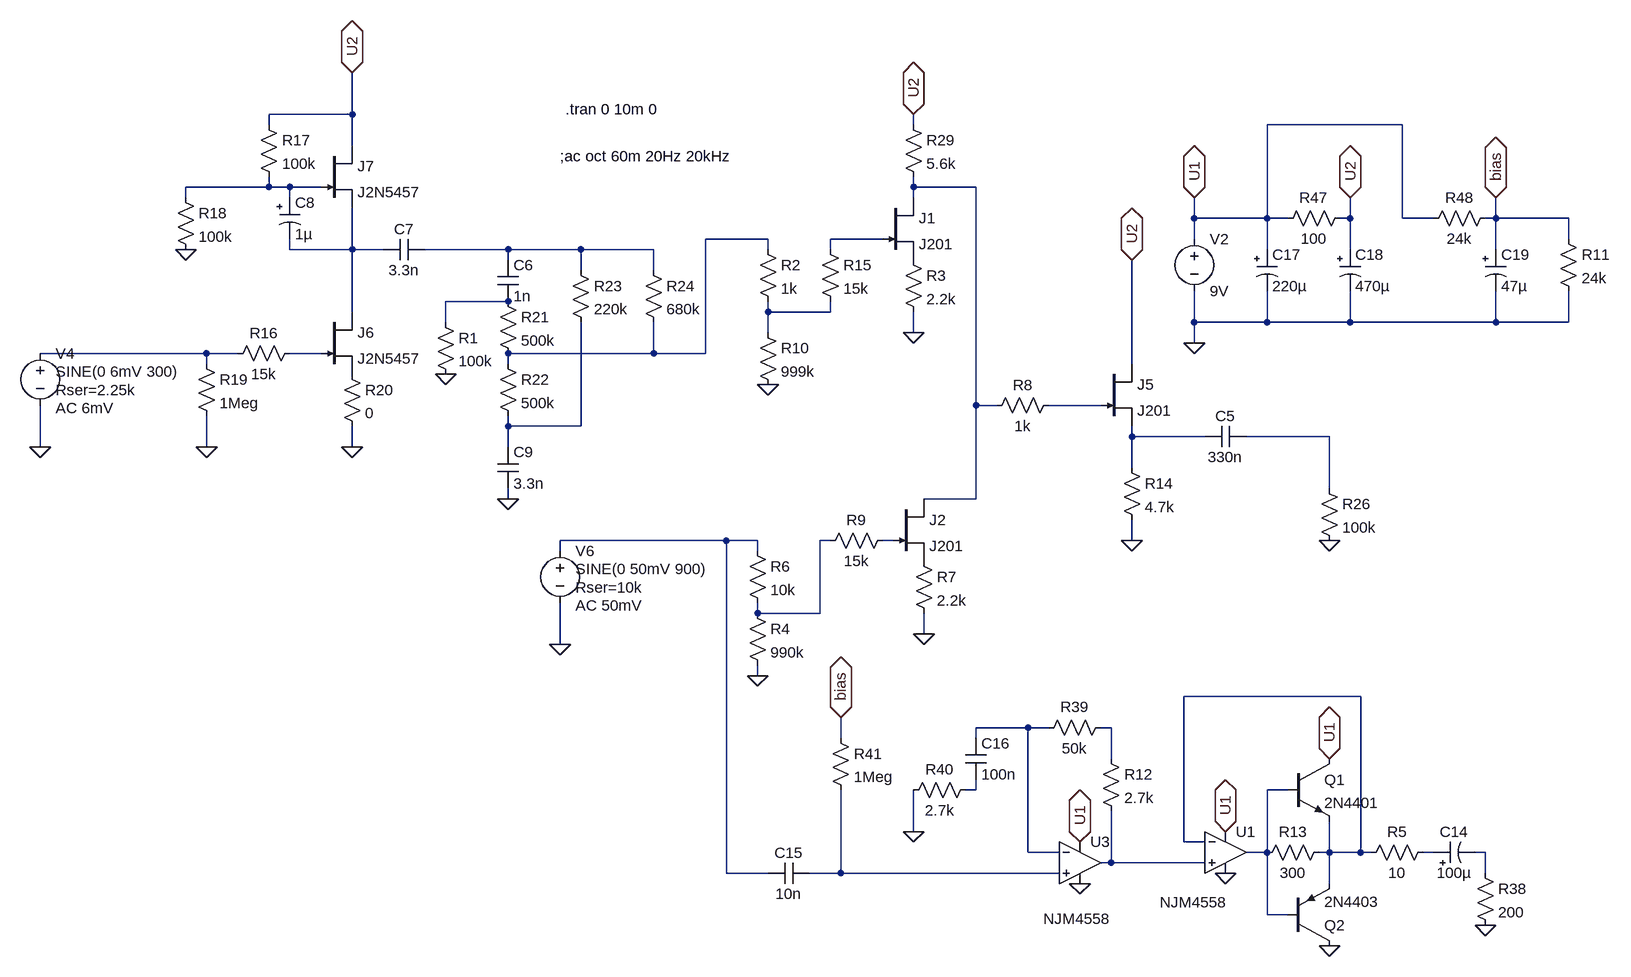
[diagram p0: schematic spudnik reverb pedal.asc]
spudnik reverb pedal.asc, the LTspice schematic file:
Version 4
SHEET 1 2768 708
WIRE -3040 -1296 -3040 -1360
WIRE -3040 -1296 -3168 -1296
WIRE -3168 -1280 -3168 -1296
WIRE -2176 -1280 -2176 -1296
WIRE -1424 -1280 -1632 -1280
WIRE -3040 -1248 -3040 -1296
WIRE -3168 -1184 -3168 -1200
WIRE -3168 -1184 -3296 -1184
WIRE -3136 -1184 -3168 -1184
WIRE -3088 -1184 -3136 -1184
WIRE -2176 -1184 -2176 -1200
WIRE -2080 -1184 -2176 -1184
WIRE -3296 -1168 -3296 -1184
WIRE -3136 -1168 -3136 -1184
WIRE -2176 -1168 -2176 -1184
WIRE -1744 -1136 -1744 -1168
WIRE -1632 -1136 -1632 -1280
WIRE -1632 -1136 -1744 -1136
WIRE -1600 -1136 -1632 -1136
WIRE -1504 -1136 -1504 -1168
WIRE -1504 -1136 -1520 -1136
WIRE -1424 -1136 -1424 -1280
WIRE -1376 -1136 -1424 -1136
WIRE -1280 -1136 -1280 -1168
WIRE -1280 -1136 -1296 -1136
WIRE -1168 -1136 -1280 -1136
WIRE -2400 -1104 -2496 -1104
WIRE -2224 -1104 -2304 -1104
WIRE -1744 -1104 -1744 -1136
WIRE -1168 -1104 -1168 -1136
WIRE -3136 -1088 -3136 -1104
WIRE -3040 -1088 -3040 -1152
WIRE -3040 -1088 -3136 -1088
WIRE -2992 -1088 -3040 -1088
WIRE -2800 -1088 -2928 -1088
WIRE -2688 -1088 -2800 -1088
WIRE -2576 -1088 -2688 -1088
WIRE -2400 -1088 -2400 -1104
WIRE -2304 -1088 -2304 -1104
WIRE -1632 -1088 -1632 -1136
WIRE -1504 -1088 -1504 -1136
WIRE -1280 -1088 -1280 -1136
WIRE -2800 -1072 -2800 -1088
WIRE -2688 -1056 -2688 -1088
WIRE -2576 -1056 -2576 -1088
WIRE -2800 -1008 -2896 -1008
WIRE -3040 -992 -3040 -1088
WIRE -2400 -992 -2400 -1008
WIRE -2304 -992 -2304 -1008
WIRE -2304 -992 -2400 -992
WIRE -2896 -976 -2896 -1008
WIRE -1744 -976 -1744 -1024
WIRE -1632 -976 -1632 -1024
WIRE -1632 -976 -1744 -976
WIRE -1504 -976 -1504 -1024
WIRE -1504 -976 -1632 -976
WIRE -1280 -976 -1280 -1024
WIRE -1280 -976 -1504 -976
WIRE -1168 -976 -1168 -1024
WIRE -1168 -976 -1280 -976
WIRE -2400 -960 -2400 -992
WIRE -2176 -960 -2176 -992
WIRE -1744 -944 -1744 -976
WIRE -3264 -928 -3520 -928
WIRE -3216 -928 -3264 -928
WIRE -3088 -928 -3136 -928
WIRE -2576 -928 -2576 -976
WIRE -2576 -928 -2800 -928
WIRE -2496 -928 -2496 -1104
WIRE -2496 -928 -2576 -928
WIRE -3264 -912 -3264 -928
WIRE -2800 -912 -2800 -928
WIRE -1840 -912 -1840 -1072
WIRE -2080 -848 -2080 -1184
WIRE -2048 -848 -2080 -848
WIRE -1888 -848 -1968 -848
WIRE -2800 -816 -2800 -832
WIRE -2688 -816 -2688 -976
WIRE -2688 -816 -2800 -816
WIRE -1840 -800 -1840 -816
WIRE -1728 -800 -1840 -800
WIRE -1536 -800 -1664 -800
WIRE -3520 -784 -3520 -848
WIRE -3264 -784 -3264 -832
WIRE -3040 -784 -3040 -816
WIRE -2800 -784 -2800 -816
WIRE -1840 -752 -1840 -800
WIRE -1536 -720 -1536 -800
WIRE -2800 -704 -2800 -720
WIRE -2080 -704 -2080 -848
WIRE -2080 -704 -2160 -704
WIRE -2464 -640 -2720 -640
WIRE -2416 -640 -2464 -640
WIRE -2304 -640 -2320 -640
WIRE -2208 -640 -2224 -640
WIRE -1840 -640 -1840 -672
WIRE -2720 -624 -2720 -640
WIRE -2416 -624 -2416 -640
WIRE -2416 -528 -2416 -544
WIRE -2320 -528 -2320 -640
WIRE -2320 -528 -2416 -528
WIRE -2160 -496 -2160 -528
WIRE -2720 -480 -2720 -544
WIRE -2416 -432 -2416 -448
WIRE -1488 -400 -1760 -400
WIRE -2000 -352 -2080 -352
WIRE -1968 -352 -2000 -352
WIRE -1872 -352 -1888 -352
WIRE -2288 -336 -2288 -368
WIRE -2080 -336 -2080 -352
WIRE -1872 -304 -1872 -352
WIRE -2080 -256 -2080 -272
WIRE -2080 -256 -2096 -256
WIRE -1600 -256 -1632 -256
WIRE -2176 -192 -2176 -256
WIRE -1760 -176 -1760 -400
WIRE -1728 -176 -1760 -176
WIRE -2000 -160 -2000 -352
WIRE -1952 -160 -2000 -160
WIRE -1632 -160 -1632 -256
WIRE -1632 -160 -1664 -160
WIRE -1536 -160 -1536 -208
WIRE -1536 -160 -1552 -160
WIRE -1488 -160 -1488 -400
WIRE -1488 -160 -1536 -160
WIRE -1472 -160 -1488 -160
WIRE -1376 -160 -1392 -160
WIRE -1296 -160 -1312 -160
WIRE -1872 -144 -1872 -224
WIRE -1872 -144 -1888 -144
WIRE -1728 -144 -1872 -144
WIRE -2464 -128 -2464 -640
WIRE -2400 -128 -2464 -128
WIRE -2288 -128 -2288 -256
WIRE -2288 -128 -2336 -128
WIRE -1952 -128 -2288 -128
WIRE -1296 -128 -1296 -160
WIRE -1536 -112 -1536 -160
WIRE -1632 -64 -1632 -160
WIRE -1600 -64 -1632 -64
FLAG -2720 -480 0
FLAG -1744 -944 0
FLAG -3296 -1088 0
FLAG -3264 -784 0
FLAG -3040 -784 0
FLAG -3520 -784 0
FLAG -3040 -1360 U2
IOPIN -3040 -1360 BiDir
FLAG -2160 -496 0
FLAG -2896 -896 0
FLAG -2800 -704 0
FLAG -2400 -880 0
FLAG -2176 -960 0
FLAG -2176 -1296 U2
IOPIN -2176 -1296 BiDir
FLAG -2416 -432 0
FLAG -1840 -640 0
FLAG -1536 -640 0
FLAG -1840 -1072 U2
IOPIN -1840 -1072 BiDir
FLAG -1696 -128 0
FLAG -1296 -48 0
FLAG -1744 -1168 U1
IOPIN -1744 -1168 BiDir
FLAG -1920 -112 0
FLAG -2176 -192 0
FLAG -1504 -1168 U2
IOPIN -1504 -1168 BiDir
FLAG -1280 -1168 bias
IOPIN -1280 -1168 BiDir
FLAG -1920 -176 U1
IOPIN -1920 -176 BiDir
FLAG -1696 -192 U1
IOPIN -1696 -192 BiDir
FLAG -2288 -368 bias
IOPIN -2288 -368 BiDir
FLAG -1536 -304 U1
IOPIN -1536 -304 BiDir
FLAG -1536 -16 0
DATAFLAG -1280 -1120 ""
DATAFLAG -2112 -128 ""
DATAFLAG -1936 -848 ""
DATAFLAG -1760 -800 ""
DATAFLAG -3040 -1328 ""
SYMBOL voltage -2720 -640 R0
WINDOW 39 24 72 Left 2
WINDOW 3 24 44 Left 2
WINDOW 123 24 100 Left 2
SYMATTR SpiceLine Rser=10k
SYMATTR Value SINE(0 50mV 900)
SYMATTR Value2 AC 50mV
SYMATTR InstName V6
SYMBOL voltage -1744 -1120 R0
WINDOW 123 0 0 Left 0
WINDOW 39 0 0 Left 0
SYMATTR InstName V2
SYMATTR Value 9V
SYMBOL njf -3088 -992 R0
SYMATTR InstName J6
SYMATTR Value J2N5457
SYMBOL njf -3088 -1248 R0
SYMATTR InstName J7
SYMATTR Value J2N5457
SYMBOL res -3120 -944 R90
WINDOW 0 0 56 VBottom 2
WINDOW 3 32 56 VTop 2
SYMATTR InstName R16
SYMATTR Value 15k
SYMBOL res -3184 -1296 R0
SYMATTR InstName R17
SYMATTR Value 100k
SYMBOL res -3312 -1184 R0
SYMATTR InstName R18
SYMATTR Value 100k
SYMBOL res -3280 -928 R0
SYMATTR InstName R19
SYMATTR Value 1Meg
SYMBOL res -3056 -912 R0
SYMATTR InstName R20
SYMATTR Value 0
SYMBOL cap -2928 -1104 R90
WINDOW 0 0 32 VBottom 2
WINDOW 3 32 32 VTop 2
SYMATTR InstName C7
SYMATTR Value 3.3n
SYMBOL voltage -3520 -944 R0
WINDOW 39 24 72 Left 2
WINDOW 3 24 44 Left 2
WINDOW 123 24 100 Left 2
SYMATTR SpiceLine Rser=2.25k
SYMATTR Value SINE(0 6mV 300)
SYMATTR Value2 AC 6mV
SYMATTR InstName V4
SYMBOL polcap -3152 -1168 R0
SYMATTR Value 1µ
SYMATTR InstName C8
SYMATTR Description Capacitor
SYMATTR Type cap
SYMATTR SpiceLine V=16 Irms=4.08248 Rser=0.015 Lser=0
SYMBOL njf -2208 -704 R0
SYMATTR InstName J2
SYMATTR Value J201
SYMBOL res -2176 -624 R0
SYMATTR InstName R7
SYMATTR Value 2.2k
SYMBOL res -2912 -992 R0
SYMATTR InstName R1
SYMATTR Value 100k
SYMBOL cap -2816 -1072 R0
SYMATTR InstName C6
SYMATTR Value 1n
SYMBOL res -2816 -1024 R0
SYMATTR InstName R21
SYMATTR Value 500k
SYMBOL res -2816 -928 R0
SYMATTR InstName R22
SYMATTR Value 500k
SYMBOL cap -2816 -784 R0
SYMATTR InstName C9
SYMATTR Value 3.3n
SYMBOL res -2704 -1072 R0
SYMATTR InstName R23
SYMATTR Value 220k
SYMBOL res -2592 -1072 R0
SYMATTR InstName R24
SYMATTR Value 680k
SYMBOL njf -2224 -1168 R0
SYMATTR InstName J1
SYMATTR Value J201
SYMBOL res -2416 -1104 R0
SYMATTR InstName R2
SYMATTR Value 1k
SYMBOL res -2192 -1088 R0
SYMATTR InstName R3
SYMATTR Value 2.2k
SYMBOL res -2192 -1296 R0
SYMATTR InstName R29
SYMATTR Value 5.6k
SYMBOL res -2416 -976 R0
SYMATTR InstName R10
SYMATTR Value 999k
SYMBOL res -2432 -640 R0
SYMATTR InstName R6
SYMATTR Value 10k
SYMBOL njf -1888 -912 R0
SYMATTR InstName J5
SYMATTR Value J201
SYMBOL res -1856 -768 R0
SYMATTR InstName R14
SYMATTR Value 4.7k
SYMBOL cap -1664 -816 R90
WINDOW 0 0 32 VBottom 2
WINDOW 3 32 32 VTop 2
SYMATTR InstName C5
SYMATTR Value 330n
SYMBOL res -1552 -736 R0
SYMATTR InstName R26
SYMATTR Value 100k
SYMBOL res -1312 -144 R0
SYMATTR InstName R38
SYMATTR Value 200
SYMBOL polcap -1376 -144 R270
WINDOW 3 0 32 VBottom 2
WINDOW 0 32 32 VTop 2
SYMATTR Value 100µ
SYMATTR InstName C14
SYMATTR Description Capacitor
SYMATTR Type cap
SYMATTR SpiceLine V=16 Irms=4.08248 Rser=0.015 Lser=0
SYMBOL cap -2336 -144 R90
WINDOW 0 0 32 VBottom 2
WINDOW 3 32 32 VTop 2
SYMATTR InstName C15
SYMATTR Value 10n
SYMBOL res -1872 -368 R90
WINDOW 0 0 56 VBottom 2
WINDOW 3 32 56 VTop 2
SYMATTR InstName R39
SYMATTR Value 50k
SYMBOL res -2080 -272 R90
WINDOW 0 0 56 VBottom 2
WINDOW 3 32 56 VTop 2
SYMATTR InstName R40
SYMATTR Value 2.7k
SYMBOL polcap -1648 -1088 R0
SYMATTR Value 220µ
SYMATTR InstName C17
SYMATTR Description Capacitor
SYMATTR Type cap
SYMATTR SpiceLine V=16 Irms=4.08248 Rser=0.015 Lser=0
SYMBOL polcap -1520 -1088 R0
SYMATTR Value 470µ
SYMATTR InstName C18
SYMATTR Description Capacitor
SYMATTR Type cap
SYMATTR SpiceLine V=16 Irms=4.08248 Rser=0.015 Lser=0
SYMBOL res -1504 -1152 R90
WINDOW 0 0 56 VBottom 2
WINDOW 3 32 56 VTop 2
SYMATTR InstName R47
SYMATTR Value 100
SYMBOL polcap -1296 -1088 R0
SYMATTR Value 47µ
SYMATTR InstName C19
SYMATTR Description Capacitor
SYMATTR Type cap
SYMATTR SpiceLine V=16 Irms=4.08248 Rser=0.015 Lser=0
SYMBOL res -1280 -1152 R90
WINDOW 0 0 56 VBottom 2
WINDOW 3 32 56 VTop 2
SYMATTR InstName R48
SYMATTR Value 24k
SYMBOL res -2304 -352 R0
SYMATTR InstName R41
SYMATTR Value 1Meg
SYMBOL cap -2096 -336 R0
SYMATTR InstName C16
SYMATTR Value 100n
SYMBOL res -2432 -544 R0
SYMATTR InstName R4
SYMATTR Value 990k
SYMBOL res -2208 -656 R90
WINDOW 0 0 56 VBottom 2
WINDOW 3 32 56 VTop 2
SYMATTR InstName R9
SYMATTR Value 15k
SYMBOL res -1184 -1120 R0
SYMATTR InstName R11
SYMATTR Value 24k
SYMBOL res -1952 -864 R90
WINDOW 0 0 56 VBottom 2
WINDOW 3 32 56 VTop 2
SYMATTR InstName R8
SYMATTR Value 1k
SYMBOL res -1376 -176 R90
WINDOW 0 0 56 VBottom 2
WINDOW 3 32 56 VTop 2
SYMATTR InstName R5
SYMATTR Value 10
SYMBOL OpAmps\\NJM4558 -1920 -208 R0
WINDOW 3 -56 150 Left 2
SYMATTR InstName U3
SYMBOL OpAmps\\NJM4558 -1696 -224 R0
WINDOW 3 -101 141 Left 2
SYMATTR InstName U1
SYMBOL res -1888 -320 R0
SYMATTR InstName R12
SYMATTR Value 2.7k
SYMBOL res -1536 -176 R90
WINDOW 0 0 56 VBottom 2
WINDOW 3 32 56 VTop 2
SYMATTR InstName R13
SYMATTR Value 300
SYMBOL npn -1600 -304 R0
SYMATTR InstName Q1
SYMATTR Value 2N4401
SYMBOL pnp -1600 -16 M180
SYMATTR InstName Q2
SYMATTR Value 2N4403
SYMBOL res -2320 -1104 R0
SYMATTR InstName R15
SYMATTR Value 15k
TEXT -2712 -1304 Left 2 !.tran 0 10m 0
TEXT -2720 -1232 Left 2 !;ac oct 60m 20Hz 20kHz

The netlist it stands for:
* spudnik reverb pedal.asc
V6 N015 0 SINE(0 50mV 900) AC 50mV Rser=10k
V2 U1 0 9V
J6 N005 N010 P001 J2N5457
J7 U2 N001 N005 J2N5457
R16 N010 N009 15k
R17 U2 N001 100k
R18 N001 0 100k
R19 N009 0 1Meg
R20 P001 0 0
C7 N006 N005 3.3n
V4 N009 0 SINE(0 6mV 300) AC 6mV Rser=2.25k
C8 N001 N005 1µ V=16 Irms=4.08248 Rser=0.015 Lser=0
J2 N002 N017 P002 J201
R7 P002 0 2.2k
R1 N007 0 100k
C6 N006 N007 1n
R21 N007 N003 500k
R22 N003 N012 500k
C9 N012 0 3.3n
R23 N006 N012 220k
R24 N006 N003 680k
J1 N002 N004 P003 J201
R2 N003 N008 1k
R3 P003 0 2.2k
R29 U2 N002 5.6k
R10 N008 0 999k
R6 N015 N016 10k
J5 U2 N011 N013 J201
R14 N013 0 4.7k
C5 N014 N013 330n
R26 N014 0 100k
R38 N024 0 200
C14 N023 N024 100µ V=16 Irms=4.08248 Rser=0.015 Lser=0
C15 N026 N015 10n
R39 N020 N019 50k
R40 N021 0 2.7k
C17 U1 0 220µ V=16 Irms=4.08248 Rser=0.015 Lser=0
C18 U2 0 470µ V=16 Irms=4.08248 Rser=0.015 Lser=0
R47 U2 U1 100
C19 bias 0 47µ V=16 Irms=4.08248 Rser=0.015 Lser=0
R48 bias U1 24k
R41 bias N026 1Meg
C16 N019 N021 100n
R4 N016 0 990k
R9 N017 N016 15k
R11 bias 0 24k
R8 N011 N002 1k
R5 N023 N018 10
XU3 N026 N019 U1 0 N025 NJM4558  ; pins In+ In- V+ V- OUT
XU1 N025 N018 U1 0 N022 NJM4558  ; pins In+ In- V+ V- OUT
R12 N020 N025 2.7k
R13 N018 N022 300
Q1 U1 N022 N018 0 2N4401
Q2 0 N022 N018 0 2N4403
R15 N004 N008 15k
.model NPN NPN
.model PNP PNP
.lib standard.bjt
.model NJF NJF
.model PJF PJF
.lib standard.jft
.tran 0 10m 0
;ac oct 60m 20Hz 20kHz
.backanno
.end